# Altium schematic sheet 3V3_1V2.SchDoc
size A3; SheetNumber: 1; SheetTotal: 1
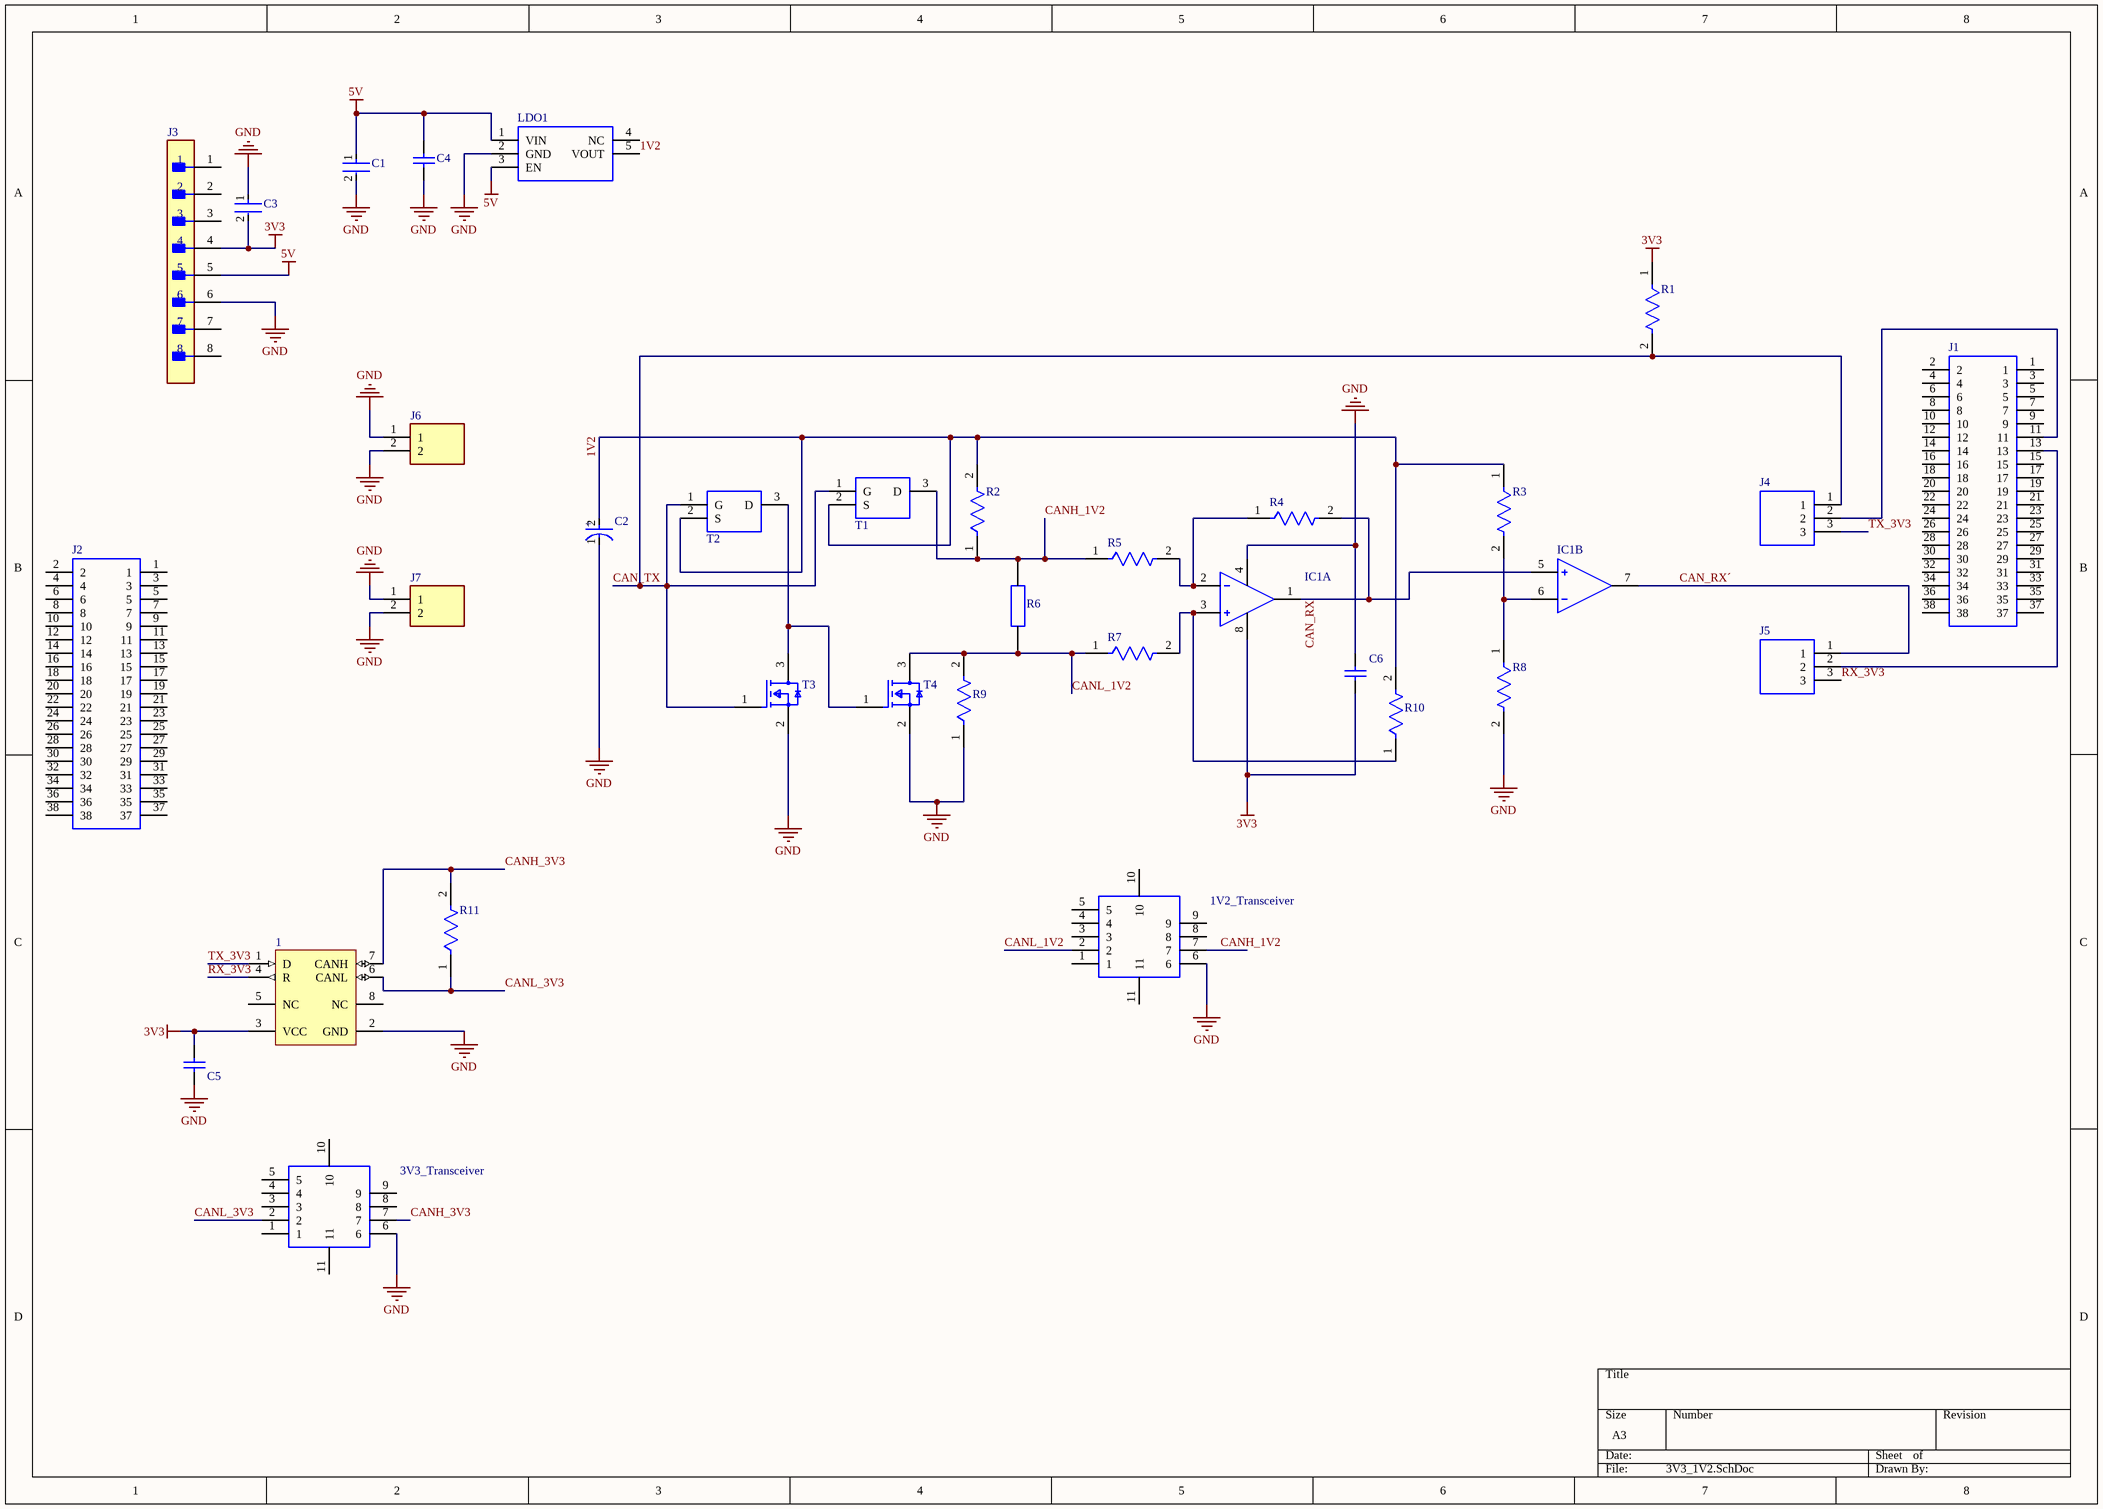
[diagram p0: 3V3_1V2.SchDoc]

## Parts
1  SN65HVD232DR  [D0008A_M]  (value not drawn)
1V2_Transceiver  5747840-6  [TE-5747840-6]  (value not drawn)
3V3_Transceiver  5747840-6  [TE-5747840-6]  (value not drawn)
C1  C2012X7R1E105K125AB  [FP-C2012-125-0_2-IPC_B]  (value not drawn)
C2  20TQC100MD2  [FP-POSCAP-D2-MFG]  (value not drawn)
C3  C2012X7R1C225K125AB  [FP-C2012-125-0_2-MFG]  (value not drawn)
C4  C2012X7R1H104K085AA  [CAPC2013X145X20LL20]  (value not drawn)
C5  C2012X7R1H104K085AA  [CAPC2013X145X20LL20]  (value not drawn)
C6  C2012X7R1H104K085AA  [CAPC2013X145X20LL20]  (value not drawn)
IC1  TSV912AIDR  [FP-D0008A-IPC_A]  (value not drawn)  (parts A,B of 2)
J1  ESQ-119-24-T-D  [ESQ-119-Y-X-D]  (value not drawn)
J2  ESQ-119-24-T-D  [ESQ-119-Y-X-D]  (value not drawn)
J3  M20-9990846  [FP-M20-9990846-MFG]  (value not drawn)
J4  54101-S0803LF  [54101S0803LF]  (value not drawn)
J5  54101-S0803LF  [54101S0803LF]  (value not drawn)
J6  961102-6404-AR  [HDRV2W64P0X254_1X2_508X250X820P]  (value not drawn)
J7  961102-6404-AR  [HDRV2W64P0X254_1X2_508X250X820P]  (value not drawn)
LDO1  MIC5317-1.2YM5-TR  [SOT95P280X145-5N]  (value not drawn)
R1  CPF0603B100KE1  [FP-CPF0603-MFG]  (value not drawn)
R2  ERA3AEB1072V  [FP-CPF0603-MFG]  (value not drawn)
R3  CPF0603B100KE1  [FP-CPF0603-MFG]  (value not drawn)
R4  CRCW060310K0FKEA  [FP-CPF0603-MFG]  (value not drawn)
R5  CRCW060310K0FKEA  [FP-CPF0603-MFG]  (value not drawn)
R6  ERA3AEB64R9V  [ERJUP3]  (value not drawn)
R7  CRCW060310K0FKEA  [FP-CPF0603-MFG]  (value not drawn)
R8  CPF0603B100KE1  [FP-CPF0603-MFG]  (value not drawn)
R9  ERA3AEB3921V  [FP-CPF0603-MFG]  (value not drawn)
R10  ERA3AEB1962V  [FP-CPF0603-MFG]  (value not drawn)
R11  CPF0603B120RE1  [FP-CPF0603-MFG]  (value not drawn)
T1  SI2301CDS-T1-GE3  [SOT95P237X112-3N]  (value not drawn)
T2  SI2301CDS-T1-GE3  [SOT95P237X112-3N]  (value not drawn)
T3  SI2302DDS-T1-GE3  [FP-S-03946-IPC_B]  (value not drawn)
T4  SI2302DDS-T1-GE3  [FP-S-03946-IPC_B]  (value not drawn)

## Nets
3V3: 1.3(VCC) C3.2 C5.2 C6.1 IC1.8(V+) J3.4 R1.1
5V: C1.1 C4.2 J3.5 LDO1.1(VIN) LDO1.3(EN)
GND: 1.2(GND) 1V2_Transceiver.6 3V3_Transceiver.6 C1.2 C2.1(C) C3.1 C4.1 C5.1 C6.2 IC1.4(V-) J3.6 J6.1 J6.2 J7.1 J7.2 LDO1.2(GND) R8.2 R9.1 T3.2(S) T4.2(S)
1V2: C2.2(A) LDO1.5(VOUT) R2.2 R3.1 R10.2 T1.2(S) T2.2(S)
CAN_RX: IC1.1(OUT_A) IC1.5(+IN_B) R4.2
CAN_RX´: IC1.7(OUT_B) J5.1
CAN_TX: J4.1 R1.2 T1.1(G) T2.1(G) T3.1(G)
CANH_1V2: 1V2_Transceiver.7 R2.1 R5.1 R6.2 T1.3(D)
CANH_3V3: 1.7(CANH) 3V3_Transceiver.7 R11.2
CANL_1V2: 1V2_Transceiver.2 R6.1 R7.1 R9.2 T4.3(D)
CANL_3V3: 1.6(CANL) 3V3_Transceiver.2 R11.1
RX_3V3: 1.4(R) J5.3
TX_3V3: 1.1(D) J4.3
NetIC1_2: IC1.2(-IN_A) R4.1 R5.2
NetIC1_3: IC1.3(+IN_A) R7.2 R10.1
NetIC1_6: IC1.6(-IN_B) R3.2 R8.1
NetJ1_11: J1.11 J4.2
NetJ1_13: J1.13 J5.2
NetT2_3: T2.3(D) T3.3(D) T4.1(G)

Not connected (* = marked no-connect by the designer): 1 5(NC) 8(NC); 1V2_Transceiver 1 3 4 5 8 9 10 11; 3V3_Transceiver 1 3 4 5 8 9 10 11; J1 1 2 3 4 5 6 7 8 9 10 12 14 15 16 17 18 19 20 21 22 23 24 25 26 27 28 29 30 31 32 33 34 35 36 37 38; J2 1 2 3 4 5 6 7 8 9 10 11 12 13 14 15 16 17 18 19 20 21 22 23 24 25 26 27 28 29 30 31 32 33 34 35 36 37 38; J3 1 2 3 7 8; LDO1 4(NC)

## Notes on the sheet
- (in symbol CMP-05428-001280-1) +

## Library data of the parts
1 = CMP-0315-00075-2: 3.3 V Can Transceiver, 17 mA, -40 to 85 degC, 8-pin SOIC (D), Green (RoHS & no Sb/Br); Manufacturer: Texas Instruments; Supply Voltage(s)(V): 3.3; Receivers Per Package: 1; ICC(Max)(mA): 17; Rating: Catalog; Transient Pulse Protection(V): -25 to 25; Mounting Technology: Surface Mount; PartNumber: SN65HVD232DR; Code_JEDEC: MS-012AA; Eco-Plan: Green (RoHS & no Sb/Br); Isolated: No; SubFamily: CAN; Footprint: SN65HVD232; Drivers Per Package: 1; ComponentLink1URL: http://www.ti.com/general/docs/lit/getliterature.tsp?genericPartNumber=SN65HVD232&fileType=pdf; ComponentLink1Description: Datasheet; PackageDescription: 8-Pin Plastic Small Outline Integrated Circuit, 4.9 x 3.9 mm, Pitch 1.27 mm Pitch; PackageReference: D0008A; DatasheetVersion: SLOS346K; PackageVersion: revM, Jun-2011
1V2_Transceiver 3V3_Transceiver = 5747840-6: 9 way r/a PCB D plug w/screw lock,6A; Manufacturer_Name: TE Connectivity; Geometry.Height: 12.6mm; Mouser Part Number: 571-5747840-6; Mouser Price/Stock: https://www.mouser.co.uk/ProductDetail/TE-Connectivity/5747840-6?qs=x6EjVpvqMVN1FSGGZ1Dvpg%3D%3D; Manufacturer_Part_Number: 5747840-6; Datasheet Link: https://datasheet.datasheetarchive.com/originals/distributors/Datasheets_SAMA/6d328899bf3b4d94f3f5cd289f57cd42.pdf
C1 = CMP-08246-002667-1: Multilayer Ceramic Capacitors 1μF ±10% 25V X7R SMD 0805; Capacitance: 1uF; Series: C; Radiation Hardening: No; REACH SVHC: No SVHC; Case/Package: 0805; RoHS Compliant: Yes; Case Code (Imperial): 0805; Voltage Rating: 25V; Height: 1.25mm; Lead Free: Lead Free; Mount: Surface Mount; Dielectric Material: Ceramic; Package Quantity: 1; Width: 0.049inch; Max Operating Temperature: 125°C; Case Code (Metric): 2012; Thickness: 0.057inch; Depth: 1.25mm; Min Operating Temperature: -55°C; Packaging: Tape and Reel; Tolerance: 10%; Voltage: 25V; Length: 2mm; Termination: SMD/SMT; Dielectric: X7R; Weight: 0.000194oz; Resistor Type: Ceramic; Construction: Flat; Number of Pins: 2; Voltage Rating (DC): 25V
C2 = CMP-05428-001280-1: Molded Tantalum Polymer Capacitor 100uF 20% 20V life 2000Hours SMD 2917; ESR (Equivalent Series Resistance): 100mR; Features: General Purpose; Case/Package: 2917; Packaging: Cut Tape; Tolerance: 20%; Mount: Surface Mount; RoHS Compliant: Yes; Max Operating Temperature: 105°C; Min Operating Temperature: -55°C; Series: POSCAP™ TQC; Life (Hours): 2000Hour; Case Code (Metric): 7343; Voltage Rating: 20V; Capacitance: 100uF; Case Code (Imperial): 2917
C3 = CMP-08246-006241-1: Multilayer Ceramic Capacitors 2.2μF ±10% 16V X7R SMD 0805; Capacitance: 2.2uF; Radiation Hardening: No; Series: C; REACH SVHC: No SVHC; Max Operating Temperature: 125°C; Case Code (Metric): 2012; Construction: Flat; Lead Free: Lead Free; Number of Pins: 2; Voltage Rating: 16V; Min Operating Temperature: -55°C; Voltage Rating (DC): 16V; Package Quantity: 2000; Thickness: 0.057inch; Case Code (Imperial): 0805; RoHS Compliant: Yes; Length: 2mm; Depth: 1.25mm; Packaging: Tape and Reel; Tolerance: 10%; Mount: Surface Mount; Dielectric: X7R; Width: 1.25mm; Case/Package: 0805; Weight: 0.000194oz; Dielectric Material: Ceramic; Termination: SMD/SMT; Voltage: 16V; Resistor Type: Ceramic; Height: 1.25mm
C4-C6 = CMP-2000-07557-1: Chip Capacitor, 0.1 uF, +/- 10%, 50 V, -55 to 125 degC, 0805 (2012 Metric), RoHS, Tape and Reel; Manufacturer: TDK; Voltage Rating: 50V; Dielectric Material: Ceramic; Capacitance: 100nF; Dielectric: X7R; Datasheet Version: 07/2017; Max Operating Temperature: 125degC; RoHSCompliant: True; Min Operating Temperature: -55degC; Case/Package: 0805; Composition: Ceramic; Width: 0.049inch; Thickness: 0.037inch; Datasheet URL: https://product.tdk.com/info/en/catalog/datasheets/mlcc_commercial_general_en.pdf; Height: 0.85mm; Voltage Rating (DC): 50V; Voltage: 50V; Packaging: TapeandReel; Mounting Technology: SurfaceMount; Case Code (Metric): 2012; Length: 2mm; Radiation Hardening: No; Number of Pins: 2; REACH SVHC: NoSVHC; Lead Free: LeadFree; Package Reference: 805; Weight: 0.000194oz; Tolerance: 10%; Package Description: 2-Pin Surface Mount Device, Body 2 x 1.25 mm; Manufacturer URL: http://www.tdk.com/; Package Quantity: 1; Case Code (Imperial): 0805; Mount: SurfaceMount; Depth: 1.25mm; Termination: SMD/SMT
IC1 = CMP-04895-000476-1: IC OPAMP GP 2 CIRCUIT 8SOIC; Number of Circuits: 2; Slew Rate: 4.5V/µs; Gain Bandwidth Product: 8MHz; Input Bias Current: 1pA; Operating Supply Current: 550uA; -3db Bandwidth: 80kHz; Amplifier Type: GENERAL PURPOSE; Input Offset Voltage (Vos): 300uV; Series: -; RoHS Compliant: Yes; Number of Pins: 8; Max Operating Temperature: 85°C; Mount: Surface Mount; Case/Package: SOIC; Packaging: Cut Tape; Number of Channels: 2; Min Operating Temperature: -40°C
J1 J2 = ESQ-119-24-T-D: .100" PC/104 Elevated Socket Strip,  positions per row,  row; Manufacturer_Name: SAMTEC; Mouser Part Number: 200-ESQ11924TD; Mouser Price/Stock: https://www.mouser.co.uk/ProductDetail/Samtec/ESQ-119-24-T-D?qs=Cqqh%252BS766wn0%252Bf8oeyus2A%3D%3D; Manufacturer_Part_Number: ESQ-119-24-T-D; Datasheet Link: http://suddendocs.samtec.com/prints/esq-1xx-xx-x-x-xxx-xx-x-xx-mkt.pdf
J3 = CMP-15831-000033-1: CONN HEADER VERT 8POS 2.54MM; Connector Type: Male Pin; Gender: Male; Insulation Resistance: 1GR; Number of Positions: 8; Contact Resistance: 30mR; Current Rating: 3A; Termination: Solder; Case/Package: SIL; RoHS Compliant: Yes; Series: M20; Housing Material: Nylon; Radiation Hardening: No; Package Quantity: 1000; Contact Material: Brass; Contact Plating: Tin; Max Operating Temperature: 105°C; Contact Mating Length: 0.24inch; Depth: 2.54mm; Color: Black; Number of Contacts: 8; Mount: Through Hole; Number of Rows: 1; Packaging: Bulk; Min Operating Temperature: -40°C; Max Current Rating: 3A; REACH SVHC: No SVHC; Pitch: 2.54mm; Housing Color: Black; Orientation: Straight; Length: 20.32mm; Contact Type: Male Pin
J4 J5 = 54101-S0803LF: BergStik, Board to Board connector, Unshrouded vertical Header, Through Hole, Single Row, 3 Positions, 2.54 mm Pitch.; Manufacturer_Name: Amphenol Communication Solutions; Geometry.Height: 8.58mm; Mouser Part Number: 649-54101-S0803LF; Mouser Price/Stock: https://www.mouser.co.uk/ProductDetail/Amphenol-FCI/54101-S0803LF?qs=iiM6sTJtPEc921tw16XaKg%3D%3D; Manufacturer_Part_Number: 54101-S0803LF; Datasheet Link: https://cdn.amphenol-cs.com/media/wysiwyg/files/drawing/54101.pdf
J6 J7 = 961102-6404-AR: 3M 961, 2 Way, 1 Row, Straight Pin Header; Geometry.Height: 8.2mm; Mouser Part Number: 517-9611026404AR; Mouser Price/Stock: https://www.mouser.co.uk/ProductDetail/3M-Electronic-Solutions-Division/961102-6404-AR?qs=A%252BtsDZJT%252Bi9E8bBrCfg1XA%3D%3D; Manufacturer_Name: 3M; Manufacturer_Part_Number: 961102-6404-AR; Datasheet Link: *
LDO1 = MIC5317-1.2YM5-TR: LDO Voltage Regulators Single LDO, Hi-Perf. 150mA, 1.2 Vout; Manufacturer_Name: Microchip; Geometry.Height: 1.45mm; Mouser Part Number: 998-MIC5317-1.2YM5TR; Mouser Price/Stock: https://www.mouser.co.uk/ProductDetail/Microchip-Technology/MIC5317-12YM5-TR?qs=U6T8BxXiZAUk7GFYLwZxxw%3D%3D; Manufacturer_Part_Number: MIC5317-1.2YM5-TR; Datasheet Link: http://www.microchip.com/mymicrochip/filehandler.aspx?ddocname=en579427
R1 R3 R8 = CMP-03211-008043-1: RES SMD 100KΩ 0.1% 1/16W 0603; Manufacturer: TE Connectivity; Voltage Rating: 50V; Power Rating: 0.063W; Temperature Coefficient: 25ppm/°C; Device Class L2: Resistors; Height: 0.55mm; Temperature Range High: +155°C; RoHS: TRUE; Composition: Thin Film; packaging: 1k Reel; Octopart: https://octopart.com/cpf0603b100ke1-te+connectivity-9539443; Tolerance: 0.1%; Temperature Range Low: -55°C; octopart_url: https://octopart.com/cpf0603b100ke1-te+connectivity-9539443; Category: Res; Manufacturer Part Number: CPF0603B100KE1; Resistance: 100KΩ; ComponentLink2Description: Datasheet; ComponentLink2URL: https://www.te.com/commerce/DocumentDelivery/DDEController?Action=showdoc&DocId=Data+Sheet%7F1773200%7FM%7Fpdf%7FEnglish%7FENG_DS_1773200_M.pdf%7F3-1676481-2; Device Class L1: Passive Components; Package: CPF0603; Value: 100KΩ; Series: CPF; Automotive: No; Ipc Land Pattern Name: RESC15580X45; Lead Free: Yes; Temperature: -55°C to +155°C; Device Class L3: Chip SMD Resistors
R2 = CMP-03211-002621-1: RES SMD 10.7KΩ 1% 1/16W 0603; Manufacturer: TE Connectivity; Manufacturer Part Number: CPF0603F1K0C1; Power Rating: 0.063W; Voltage Rating: 50V; Temperature Coefficient: 50ppm/°C; Octopart: https://octopart.com/cpf0603f1k0c1-te+connectivity-42013134; packaging: 1k Reel; Category: Res; Device Class L3: Chip SMD Resistors; octopart_url: https://octopart.com/cpf0603f1k0c1-te+connectivity-42013134; Value: 10.7KΩ; Temperature: -55°C to +155°C; Composition: Thin Film; ComponentLink2URL: https://www.te.com/commerce/DocumentDelivery/DDEController?Action=showdoc&DocId=Data+Sheet%7F1773200%7FM%7Fpdf%7FEnglish%7FENG_DS_1773200_M.pdf%7F3-1676481-2; Tolerance: 1%; Automotive: No; Lead Free: Yes; Height: 0.55mm; Device Class L1: Passive Components; Device Class L2: Resistors; Ipc Land Pattern Name: RESC15580X45; Series: CPF; ComponentLink2Description: Datasheet; RoHS: TRUE; Resistance: 10.7KΩ; Package: CPF0603; Temperature Range Low: -55°C; Temperature Range High: +155°C
R4 R5 R7 = CMP-03211-002621-1: RES SMD 10KΩ 1% 1/16W 0603; Manufacturer: TE Connectivity; Manufacturer Part Number: CPF0603F1K0C1; Power Rating: 0.063W; Voltage Rating: 50V; Temperature Coefficient: 50ppm/°C; Octopart: https://octopart.com/cpf0603f1k0c1-te+connectivity-42013134; packaging: 1k Reel; Category: Res; Device Class L3: Chip SMD Resistors; octopart_url: https://octopart.com/cpf0603f1k0c1-te+connectivity-42013134; Value: 10KΩ; Temperature: -55°C to +155°C; Composition: Thin Film; ComponentLink2URL: https://www.te.com/commerce/DocumentDelivery/DDEController?Action=showdoc&DocId=Data+Sheet%7F1773200%7FM%7Fpdf%7FEnglish%7FENG_DS_1773200_M.pdf%7F3-1676481-2; Tolerance: 1%; Automotive: No; Lead Free: Yes; Height: 0.55mm; Device Class L1: Passive Components; Device Class L2: Resistors; Ipc Land Pattern Name: RESC15580X45; Series: CPF; ComponentLink2Description: Datasheet; RoHS: TRUE; Resistance: 10KΩ; Package: CPF0603; Temperature Range Low: -55°C; Temperature Range High: +155°C
R6 = ERJ-UP3F56R0V: Anti-Sulfurated Thick Film Chip Resistors/ Anti-Surge Type, Power Rating (W): 0.25, Chip Size (LxW(EIA)) (mm): 1.6 x 0.8 (EIA:0603), Resistance Values (?): 64.9, Resistance Tolerance (%): 1, T.C.R (?102/K): ?100; Manufacturer_Name: Panasonic; Geometry.Height: 0.55mm; Mouser Part Number: 667-ERJ-UP3F56R0V; Mouser Price/Stock: https://www.mouser.co.uk/ProductDetail/Panasonic/ERJ-UP3F56R0V?qs=GedFDFLaBXEVyc%252BpeANJkg%3D%3D; Manufacturer_Part_Number: ERJ-UP3F56R0V; Datasheet Link: https://industrial.panasonic.com/cdbs/www-data/pdf/RDP0000/AOA0000C337.pdf
R9 = CMP-03211-002621-1: RES SMD 3.92KΩ 1% 1/16W 0603; Manufacturer: TE Connectivity; Manufacturer Part Number: CPF0603F1K0C1; Power Rating: 0.063W; Voltage Rating: 50V; Temperature Coefficient: 50ppm/°C; Octopart: https://octopart.com/cpf0603f1k0c1-te+connectivity-42013134; packaging: 1k Reel; Category: Res; Device Class L3: Chip SMD Resistors; octopart_url: https://octopart.com/cpf0603f1k0c1-te+connectivity-42013134; Value: 3.92KΩ; Temperature: -55°C to +155°C; Composition: Thin Film; ComponentLink2URL: https://www.te.com/commerce/DocumentDelivery/DDEController?Action=showdoc&DocId=Data+Sheet%7F1773200%7FM%7Fpdf%7FEnglish%7FENG_DS_1773200_M.pdf%7F3-1676481-2; Tolerance: 1%; Automotive: No; Lead Free: Yes; Height: 0.55mm; Device Class L1: Passive Components; Device Class L2: Resistors; Ipc Land Pattern Name: RESC15580X45; Series: CPF; ComponentLink2Description: Datasheet; RoHS: TRUE; Resistance: 3.92KΩ; Package: CPF0603; Temperature Range Low: -55°C; Temperature Range High: +155°C
R10 = CMP-03211-002621-1: RES SMD 19.6KΩ 1% 1/16W 0603; Manufacturer: TE Connectivity; Manufacturer Part Number: CPF0603F1K0C1; Power Rating: 0.063W; Voltage Rating: 50V; Temperature Coefficient: 50ppm/°C; Octopart: https://octopart.com/cpf0603f1k0c1-te+connectivity-42013134; packaging: 1k Reel; Category: Res; Device Class L3: Chip SMD Resistors; octopart_url: https://octopart.com/cpf0603f1k0c1-te+connectivity-42013134; Value: 19.6KΩ; Temperature: -55°C to +155°C; Composition: Thin Film; ComponentLink2URL: https://www.te.com/commerce/DocumentDelivery/DDEController?Action=showdoc&DocId=Data+Sheet%7F1773200%7FM%7Fpdf%7FEnglish%7FENG_DS_1773200_M.pdf%7F3-1676481-2; Tolerance: 1%; Automotive: No; Lead Free: Yes; Height: 0.55mm; Device Class L1: Passive Components; Device Class L2: Resistors; Ipc Land Pattern Name: RESC15580X45; Series: CPF; ComponentLink2Description: Datasheet; RoHS: TRUE; Resistance: 19.6KΩ; Package: CPF0603; Temperature Range Low: -55°C; Temperature Range High: +155°C
R11 = CMP-03211-007338-1: RES SMD 120Ω 0.1% 1/16W 0603; Manufacturer: TE Connectivity; Power Rating: 0.063W; Voltage Rating: 50V; Temperature Coefficient: 25ppm/°C; Temperature Range Low: -55°C; Resistance: 120Ω; Octopart: https://octopart.com/cpf0603b120re1-te+connectivity-9539408; ComponentLink2URL: https://www.te.com/commerce/DocumentDelivery/DDEController?Action=showdoc&DocId=Data+Sheet%7F1773200%7FM%7Fpdf%7FEnglish%7FENG_DS_1773200_M.pdf%7F3-1676481-2; Value: 120Ω; packaging: 1k Reel; Category: Res; Automotive: No; octopart_url: https://octopart.com/cpf0603b120re1-te+connectivity-9539408; Manufacturer Part Number: CPF0603B120RE1; Device Class L2: Resistors; Temperature: -55°C to +155°C; Lead Free: Yes; Device Class L1: Passive Components; ComponentLink2Description: Datasheet; Tolerance: 0.1%; Height: 0.55mm; Temperature Range High: +155°C; Series: CPF; Ipc Land Pattern Name: RESC15580X45; Composition: Thin Film; Package: CPF0603; RoHS: TRUE; Device Class L3: Chip SMD Resistors
T1 T2 = SI2301CDS-T1-GE3: SI2301CDS-T1-GE3, P-channel MOSFET Transistor 2.3 A 20 V, 3-Pin SOT-23, TO-236; Manufacturer_Name: Vishay; Geometry.Height: 1.12mm; Mouser Part Number: 781-SI2301CDS-T1-GE3; Mouser Price/Stock: https://www.mouser.co.uk/ProductDetail/Vishay-Semiconductors/SI2301CDS-T1-GE3?qs=IRuQNBqMOcnWEzfGi6KYYw%3D%3D; Manufacturer_Part_Number: SI2301CDS-T1-GE3; Datasheet Link: http://www.vishay.com/docs/68741/si2301cd.pdf
T3 T4 = CMP-02550-000243-1: MOSFET N-CH 20V 2.9A SOT23-3; Max Power Dissipation: 710mW; Number of Channels: 1; Turn-On Delay Time: 8ns; Rise Time: 7ns; Continuous Drain Current (ID): 2.6A; Drain to Source Resistance: 57mR; Gate to Source Voltage (Vgs): 8V; Turn-Off Delay Time: 30ns; RoHS Compliant: Yes; Drain to Source Voltage (Vdss): 20V; Case/Package: SOT-23; Lead Free: Lead Free; Weight: 0.050717oz; REACH SVHC: No SVHC; Max Operating Temperature: 150°C; Number of Elements: 1; Fall Time: 7ns; Packaging: Tape and Reel; Package Quantity: 3000; Number of Pins: 3; Power Dissipation: 710mW; Mount: Surface Mount; Min Operating Temperature: -55°C